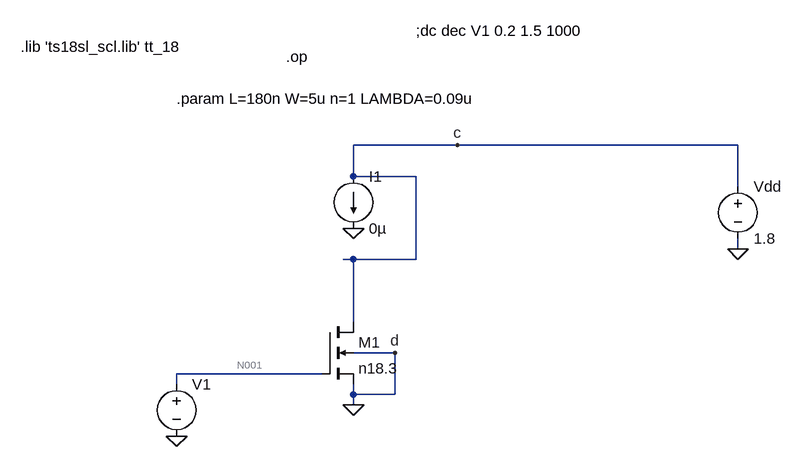
[diagram p0: schematic char_nmos1.asc]
char_nmos1.asc, the LTspice schematic file:
Version 4
SHEET 1 1308 704
WIRE 800 224 640 224
WIRE 1232 224 800 224
WIRE 640 272 640 224
WIRE 736 272 640 272
WIRE 1232 288 1232 224
WIRE 1232 384 1232 368
WIRE 640 400 624 400
WIRE 736 400 736 272
WIRE 736 400 640 400
WIRE 640 496 640 400
WIRE 704 544 640 544
WIRE 592 576 368 576
WIRE 368 592 368 576
WIRE 640 608 640 592
WIRE 704 608 704 544
WIRE 704 608 640 608
WIRE 640 624 640 608
FLAG 1232 384 0
FLAG 800 224 c
FLAG 640 624 0
FLAG 704 544 d
FLAG 368 672 0
FLAG 640 352 0
SYMBOL nmos4 592 496 R0
SYMATTR InstName M1
SYMATTR Value n18.3
SYMATTR Value2 l=1u w=0.5u ad={5*W*LAMBDA} as={5*W*LAMBDA} pd={10*LAMBDA+2*W} ps={10*LAMBDA+2*W}
SYMBOL voltage 1232 272 R0
WINDOW 123 0 0 Left 0
WINDOW 39 0 0 Left 0
SYMATTR InstName Vdd
SYMATTR Value 1.8
SYMBOL voltage 368 576 R0
WINDOW 123 0 0 Left 0
WINDOW 39 0 0 Left 0
SYMATTR InstName V1
SYMATTR Value ""
SYMBOL current 640 272 R0
WINDOW 123 0 0 Left 0
WINDOW 39 0 0 Left 0
SYMATTR InstName I1
SYMATTR Value 0µ
TEXT 128 72 Left 2 !.lib 'ts18sl_scl.lib' tt_18
TEXT 368 152 Left 2 !.param L=180n W=5u n=1 LAMBDA=0.09u
TEXT 536 88 Left 2 !.op
TEXT 736 48 Left 2 !;dc dec V1 0.2 1.5 1000

The netlist it stands for:
* char_nmos1.asc
M1 c N001 0 0 n18.3 l=1u w=0.5u ad={5*W*LAMBDA} as={5*W*LAMBDA} pd={10*LAMBDA+2*W} ps={10*LAMBDA+2*W}
Vdd c 0 1.8
V1 N001 0
I1 c 0 0µ
.model NMOS NMOS
.model PMOS PMOS
.lib standard.mos
.lib 'ts18sl_scl.lib' tt_18
.param L=180n W=5u n=1 LAMBDA=0.09u
.op
;dc dec V1 0.2 1.5 1000
.backanno
.end

* Results of the author's LTspice run, read from the files saved beside the schematic
* Operating Point:
*   V(c) = 1.8 V
*   V(n001) = 0 V
*   Id(M1) = 3.223 pA
*   Ig(M1) = 0 A
*   Ib(M1) = -1.801 pA
*   Is(M1) = -1.422 pA
*   I(I1) = 0 A
*   I(V1) = 0 A
*   I(Vdd) = -3.223 pA
* From the log:
*   Semiconductor Device Operating Points:
*                           --- BSIM3 MOSFETS ---
*   Name:        m1
*   Model:      n18.3
*   Id:        3.22e-12
*   Vgs:       0.00e+00
*   Vds:       1.80e+00
*   Vbs:       0.00e+00
*   Vth:       3.92e-01
*   Vdsat:     3.75e-02
*   Gm:        4.78e-11
*   Gds:       4.47e-14
*   Gmb        1.10e-11
*   Cbd:       1.90e-15
*   Cbs:       3.05e-15
*   Cgsov:     1.10e-16
*   Cgdov:     1.10e-16
*   Cgbov:     0.00e+00
*   dQgdVgb:   1.32e-15
*   dQgdVdb:  -1.10e-16
*   dQgdVsb:  -1.81e-16
*   dQddVgb:  -1.47e-16
*   dQddVdb:   2.01e-15
*   dQddVsb:   4.56e-17
*   dQbdVgb:  -1.02e-15
*   dQbdVdb:  -1.90e-15
*   dQbdVsb:  -3.07e-15